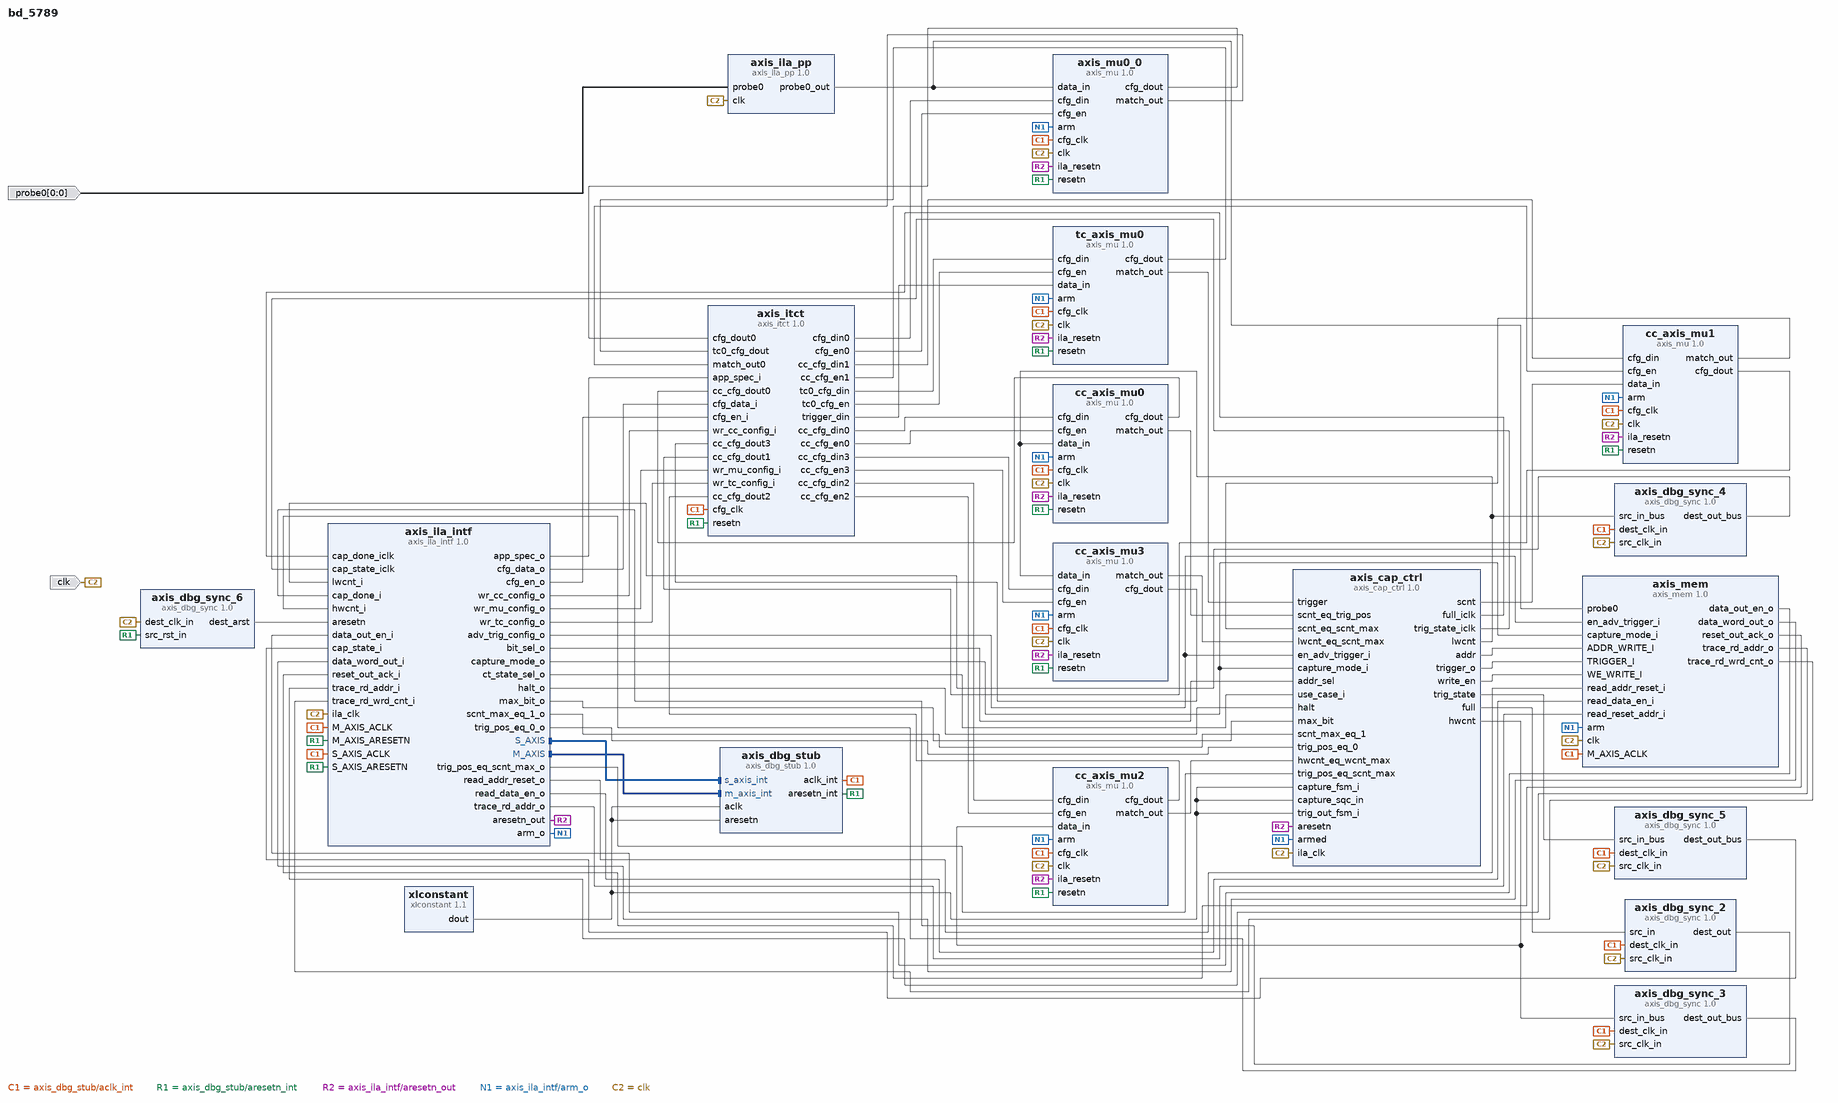
[diagram p0: block diagram of the top level]
# Vivado block design bd_5789, xcvp1202-vsva2785-2MP-e-S, Vivado 2024.2
create_bd_design bd_5789

create_bd_port -dir I -type clk clk
set_property -dict {CONFIG.ASSOCIATED_BUSIF SLOT_0_AXI CONFIG.ASSOCIATED_RESET resetn} [get_bd_ports clk]
create_bd_port -dir I -from 0 -to 0 -type data probe0

create_bd_cell -type ip -vlnv xilinx.com:ip:axis_dbg_stub:1.0 axis_dbg_stub
set_property -dict {CONFIG.C_AXIS_DATA_WIDTH 32} [get_bd_cells axis_dbg_stub]
create_bd_cell -type ip -vlnv xilinx.com:ip:xlconstant:1.1 xlconstant
set_property -dict {CONFIG.CONST_VAL 0} [get_bd_cells xlconstant]
create_bd_cell -type ip -vlnv xilinx.com:ip:axis_ila_intf:1.0 axis_ila_intf
